# Altium schematic sheet BQ24250.SchDoc
size A3; SheetNumber: 6; SheetTotal: 8
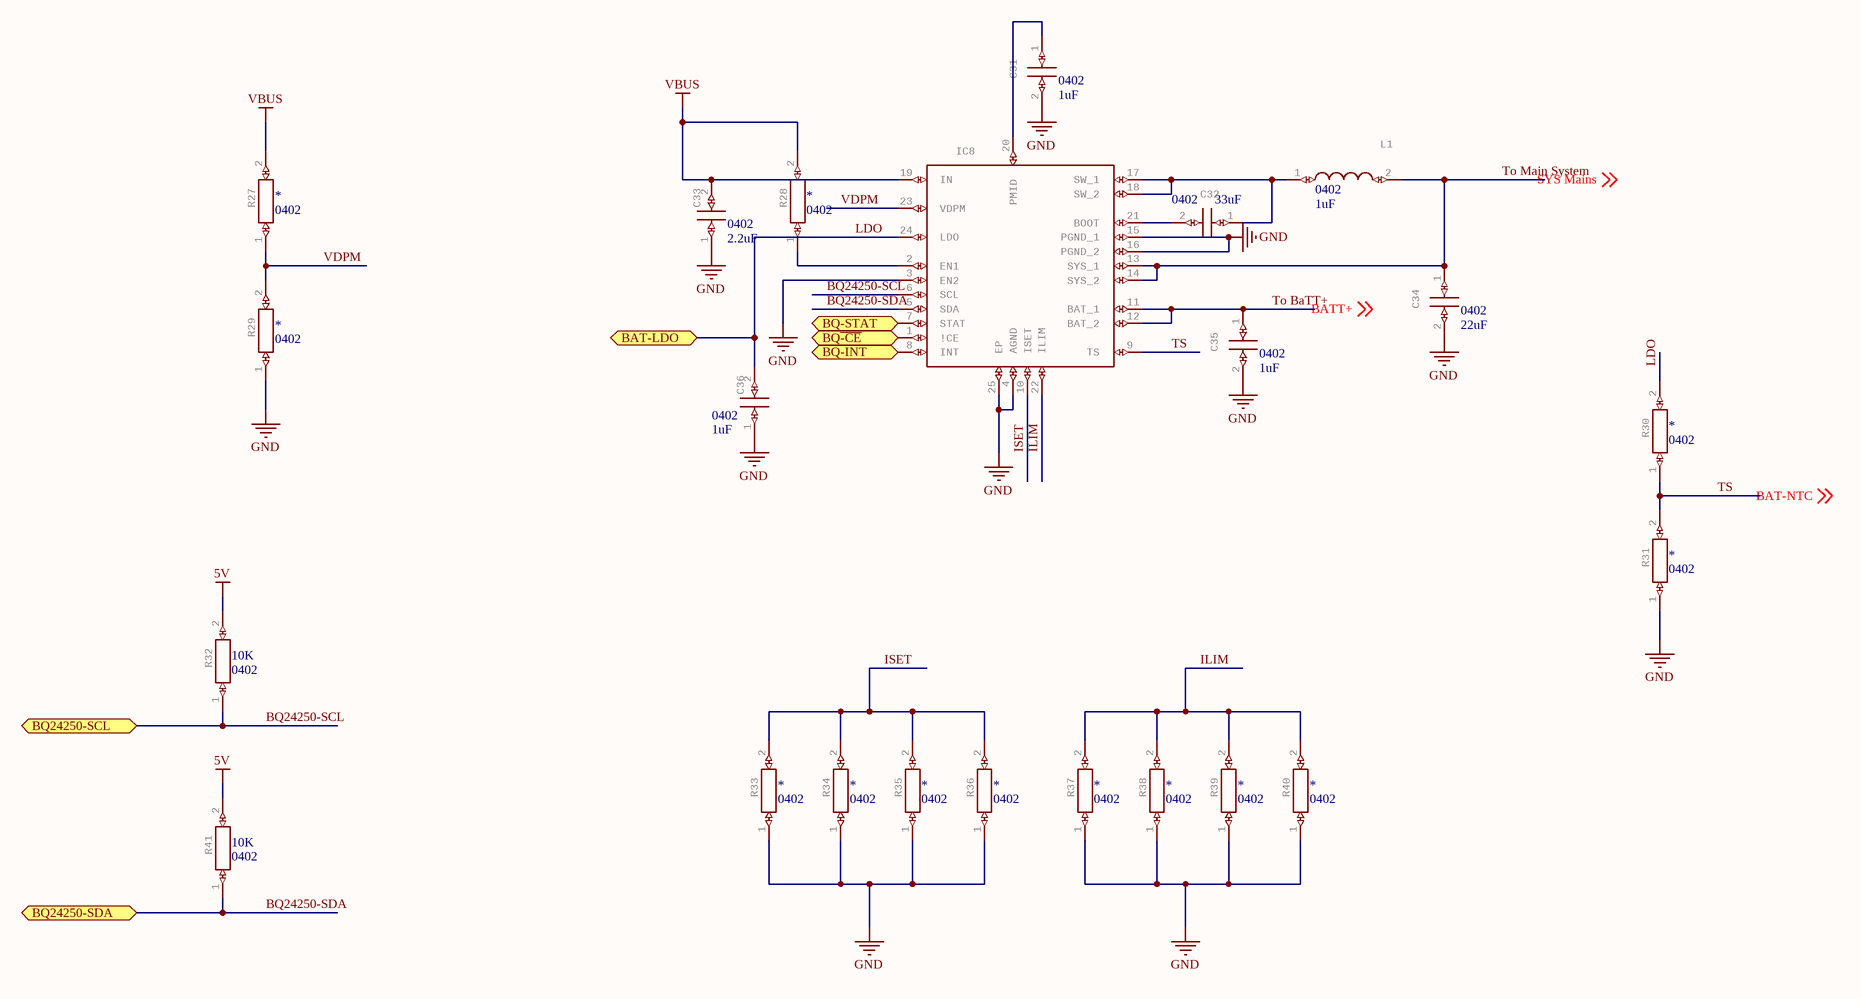
[diagram p0: BQ24250.SchDoc]

## Parts
C31  value 1uF  Package: 0402  [CAPC1005X56N]  (hidden comment: Multilayer Ceramic Capacitors MLCC - SMD/SMT 50V .1uF X7R 0402 10% Tol   Source:  Datasheet)
C32  value 33uF  Package: 0402  [CAPC1005X56N]  (hidden comment: Multilayer Ceramic Capacitors MLCC - SMD/SMT 50V .1uF X7R 0402 10% Tol   Source:  Datasheet)
C33  value 2.2uF  Package: 0402  [CAPC1005X56N]  (hidden comment: Multilayer Ceramic Capacitors MLCC - SMD/SMT 50V .1uF X7R 0402 10% Tol   Source:  Datasheet)
C34  value 22uF  Package: 0402  [CAPC1005X56N]  (hidden comment: Multilayer Ceramic Capacitors MLCC - SMD/SMT 50V .1uF X7R 0402 10% Tol   Source:  Datasheet)
C35  value 1uF  Package: 0402  [CAPC1005X56N]  (hidden comment: Multilayer Ceramic Capacitors MLCC - SMD/SMT 50V .1uF X7R 0402 10% Tol   Source:  Datasheet)
C36  value 1uF  Package: 0402  [CAPC1005X56N]  (hidden comment: Multilayer Ceramic Capacitors MLCC - SMD/SMT 50V .1uF X7R 0402 10% Tol   Source:  Datasheet)
IC8  2A Single Input I2C/Standalone Switch-Mode Li-Ion Battery Charger   Source:  Datasheet  [QFN50P400X400X100-25N]  (value not drawn)
L1  value 1uF  Package: 0402  [INDC1005X55N]  (hidden comment: Fixed Inductors INDUCTOR,MCOIL HIGH CURRENT,1.0UH 20% ,T&R   Source:  Datasheet)
R27  Package: 0402  [RESC1005X40N]  (hidden comment: GENERAL PURPOSE CHIP RESISTORS   Source:  Datasheet)
R28  Package: 0402  [RESC1005X40N]  (hidden comment: GENERAL PURPOSE CHIP RESISTORS   Source:  Datasheet)
R29  Package: 0402  [RESC1005X40N]  (hidden comment: GENERAL PURPOSE CHIP RESISTORS   Source:  Datasheet)
R30  Package: 0402  [RESC1005X40N]  (hidden comment: GENERAL PURPOSE CHIP RESISTORS   Source:  Datasheet)
R31  Package: 0402  [RESC1005X40N]  (hidden comment: GENERAL PURPOSE CHIP RESISTORS   Source:  Datasheet)
R32  value 10K  Package: 0402  [RESC1005X40N]  (hidden comment: GENERAL PURPOSE CHIP RESISTORS   Source:  Datasheet)
R33  Package: 0402  [RESC1005X40N]  (hidden comment: GENERAL PURPOSE CHIP RESISTORS   Source:  Datasheet)
R34  Package: 0402  [RESC1005X40N]  (hidden comment: GENERAL PURPOSE CHIP RESISTORS   Source:  Datasheet)
R35  Package: 0402  [RESC1005X40N]  (hidden comment: GENERAL PURPOSE CHIP RESISTORS   Source:  Datasheet)
R36  Package: 0402  [RESC1005X40N]  (hidden comment: GENERAL PURPOSE CHIP RESISTORS   Source:  Datasheet)
R37  Package: 0402  [RESC1005X40N]  (hidden comment: GENERAL PURPOSE CHIP RESISTORS   Source:  Datasheet)
R38  Package: 0402  [RESC1005X40N]  (hidden comment: GENERAL PURPOSE CHIP RESISTORS   Source:  Datasheet)
R39  Package: 0402  [RESC1005X40N]  (hidden comment: GENERAL PURPOSE CHIP RESISTORS   Source:  Datasheet)
R40  Package: 0402  [RESC1005X40N]  (hidden comment: GENERAL PURPOSE CHIP RESISTORS   Source:  Datasheet)
R41  value 10K  Package: 0402  [RESC1005X40N]  (hidden comment: GENERAL PURPOSE CHIP RESISTORS   Source:  Datasheet)

## Ports
BAT-LDO (bidir), BQ24250-SCL (bidir), BQ24250-SDA (bidir), BQ-INT (bidir), BQ-STAT (bidir), BQ~{-CE} (bidir)

## Nets
5V: R32.2 R41.2
GND: C31.2 C33.1 C34.2 C35.2 C36.1 IC8.3(EN2) IC8.4(AGND) IC8.15(PGND_1) IC8.16(PGND_2) IC8.25(EP) R29.1 R31.1 R33.1 R34.1 R35.1 R36.1 R37.1 R38.1 R39.1 R40.1
VBUS: C33.2 IC8.19(IN) R27.2 R28.2
BQ24250-SCL: IC8.6(SCL) R32.1 ; port BQ24250-SCL
BQ24250-SDA: IC8.5(SDA) R41.1 ; port BQ24250-SDA
BQ~{-CE}: IC8.1(!CE) ; port BQ~{-CE}
BQ-INT: IC8.8(INT) ; port BQ-INT
BQ-STAT: IC8.7(STAT) ; port BQ-STAT
ILIM: IC8.22(ILIM) R37.2 R38.2 R39.2 R40.2
ISET: IC8.10(ISET) R33.2 R34.2 R35.2 R36.2
LDO: C36.2 IC8.24(LDO) R30.2 ; port BAT-LDO
To BaTT+: C35.1 IC8.11(BAT_1) IC8.12(BAT_2)
To Main System: C34.1 IC8.13(SYS_1) IC8.14(SYS_2) L1.2
TS: IC8.9(TS) R30.1 R31.2
VDPM: IC8.23(VDPM) R27.1 R29.2
NetC31_1: C31.1 IC8.20(PMID)
NetC32_1: C32.1 IC8.17(SW_1) IC8.18(SW_2) L1.1
NetC32_2: C32.2 IC8.21(BOOT)
NetIC8_2: IC8.2(EN1) R28.1

## Notes on the sheet
- Labels drawn without touching a wire or pin: BAT-NTC, BATT+, SYS Mains

## Library data of the parts
C31-C36 = 04025C104KAT2A: Manufacturer_Name: AVX; GateName_1: G$1; SymbolName_1: 04025C104KAT2A; LibraryName: 04025C104KAT2A; DeviceSetName: 04025C104KAT2A; Manufacturer_Part_Number: 04025C104KAT2A; Mouser_Part_Number: 581-04025C104KAT2A; Mouser_Price-Stock: https://www.mouser.co.uk/ProductDetail/AVX/04025C104KAT2A?qs=ZBeOGGPQgEFYcwOskjAIVQ%3D%3D; Arrow_Part_Number: 04025C104KAT2A; Arrow_Price-Stock: https://www.arrow.com/en/products/04025c104kat2a/avx?region=nac; Height: 0.56mm
IC8 = BQ24250RGER: Manufacturer_Name: Texas Instruments; GateName_1: G$1; SymbolName_1: BQ24250RGER; LibraryName: BQ24250RGER; DeviceSetName: BQ24250RGER; Package: QFN50P400X400X100-25N; Manufacturer_Part_Number: BQ24250RGER; Mouser_Part_Number: 595-BQ24250RGER; Mouser_Price-Stock: https://www.mouser.co.uk/ProductDetail/Texas-Instruments/BQ24250RGER?qs=VqERlb%252BKohfBI76g9iGg8g%3D%3D; Arrow_Part_Number: BQ24250RGER; Arrow_Price-Stock: https://www.arrow.com/en/products/bq24250rger/texas-instruments; Height: 1mm
L1 = MCEE1005T1R0MHN: Manufacturer_Name: TAIYO YUDEN; GateName_1: G$1; SymbolName_1: MCEE1005T1R0MHN; LibraryName: MCEE1005T1R0MHN; DeviceSetName: MCEE1005T1R0MHN; Manufacturer_Part_Number: MCEE1005T1R0MHN; Mouser_Part_Number: 963-MCEE1005T1R0MHN; Mouser_Price-Stock: https://www.mouser.co.uk/ProductDetail/Taiyo-Yuden/MCEE1005T1R0MHN?qs=T3oQrply3y%252B0bjhIycfdaQ%3D%3D; Height: 0.55mm
R27-R41 = RC0402FR-071KL: Manufacturer_Name: KEMET; GateName_1: G$1; SymbolName_1: RC0402FR-071KL; LibraryName: RC0402FR-071KL; DeviceSetName: RC0402FR-071KL; Manufacturer_Part_Number: RC0402FR-071KL; Mouser_Part_Number: 603-RC0402FR-071KL; Mouser_Price-Stock: https://www.mouser.co.uk/ProductDetail/YAGEO/RC0402FR-071KL?qs=V1yeUXFNrknDEmWLmm5v6g%3D%3D; Arrow_Part_Number: RC0402FR-071KL; Arrow_Price-Stock: https://www.arrow.com/en/products/rc0402fr-071kl/yageo?region=nac; Height: 0.4mm
  R27-R31 R33-R40: Value: *